# EAGLE design ashield (EAGLE 5.11)
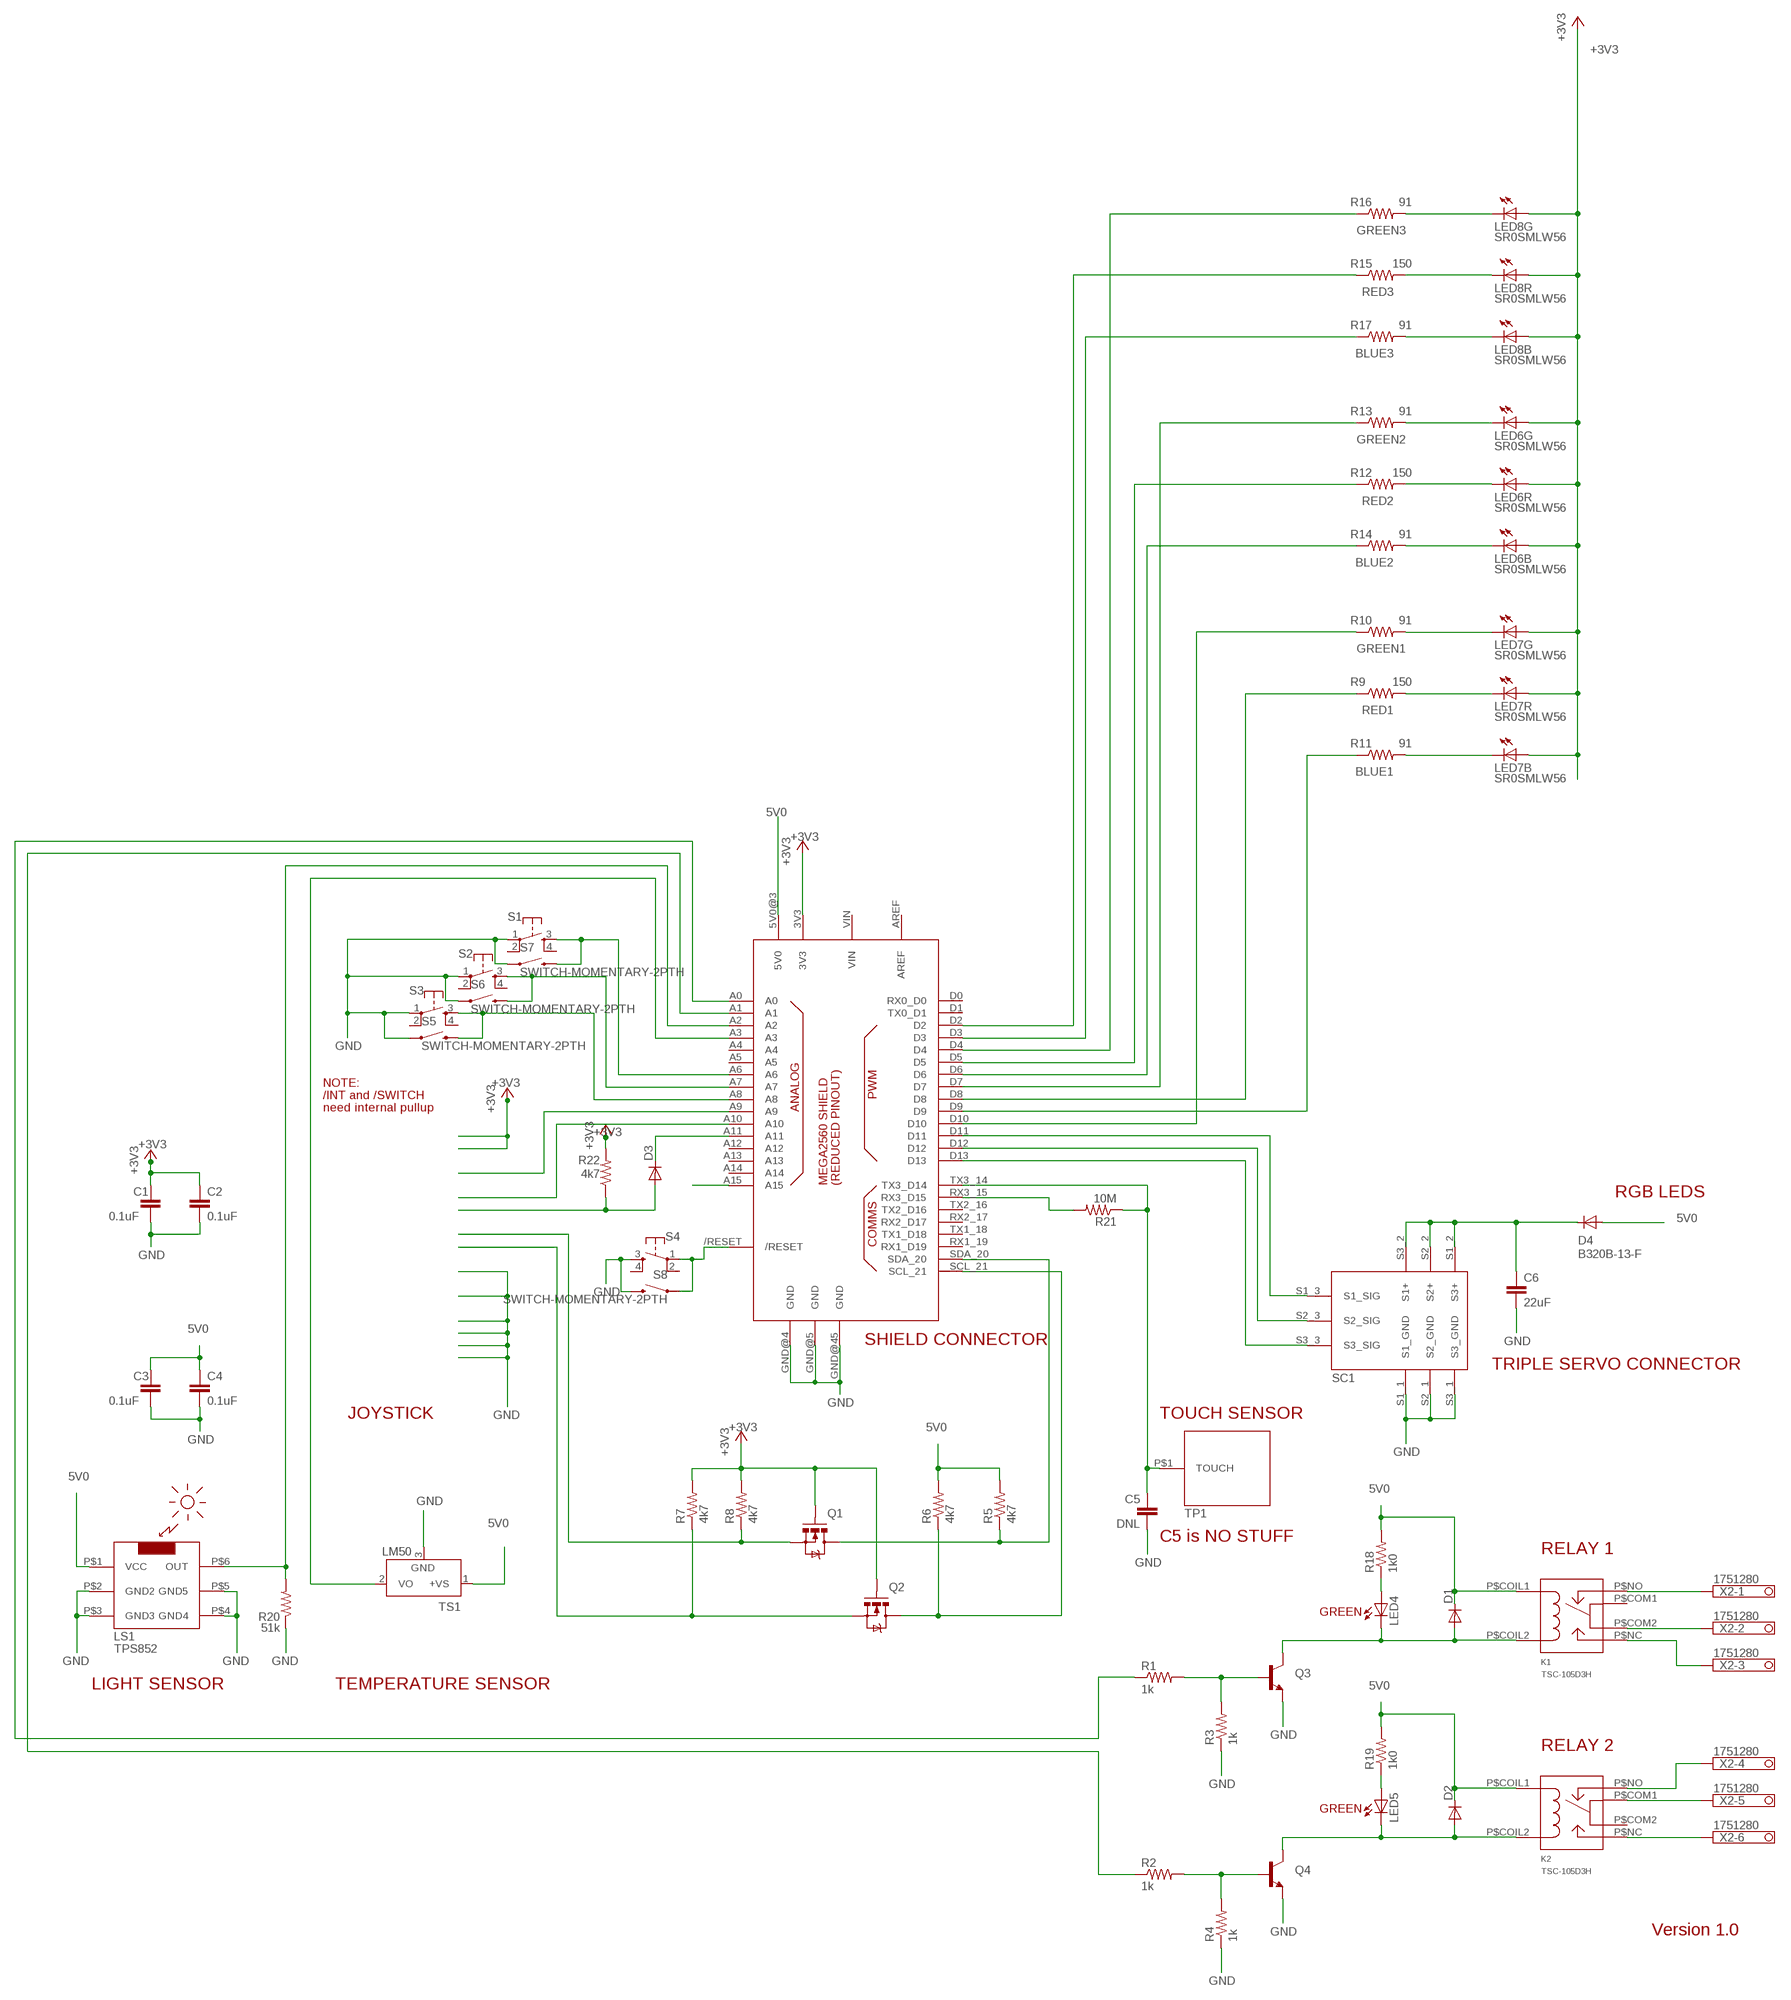
[diagram p0: schematic, sheet 1, part 1 of 2]
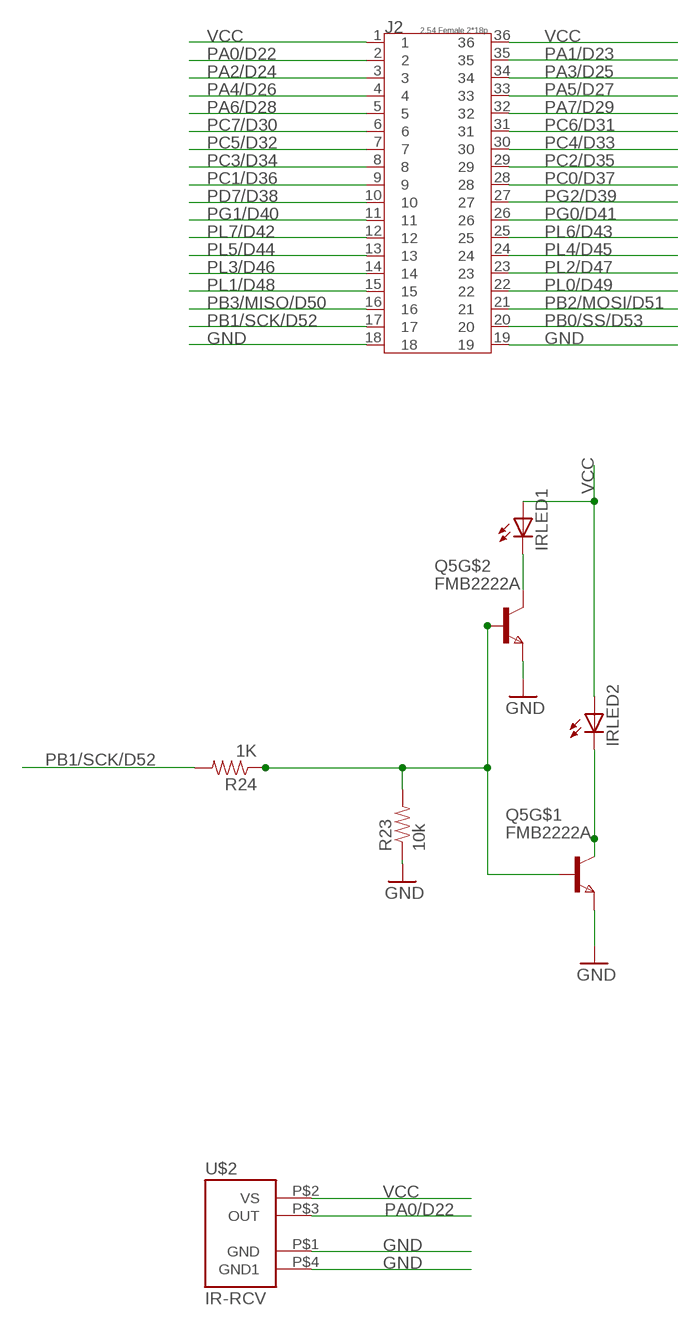
[diagram p1: schematic, sheet 1, part 2 of 2]

## Parts
BOARD1  MEGAARDUINO_REDUCED  [MEGA_ARDUINO_REDUCED]
C1  0.1uF  CAP0603-CAP  [0603-CAP]
C2  0.1uF  CAP0603-CAP  [0603-CAP]
C3  0.1uF  CAP0603-CAP  [0603-CAP]
C4  0.1uF  CAP0603-CAP  [0603-CAP]
C5  DNL  CAP0603-CAP  [0603-CAP]
C6  22uF  CAP1206  [1206]
D1  DIODESOD  [SOD-323]
D2  DIODESOD  [SOD-323]
D3  DIODESOD  [SOD-323]
D4  B320B-13-F  DIODESMA  [SMA-DIODE]
IRLED1  LED5MM  [LED5MM]
IRLED2  LED5MM  [LED5MM]
J2  2.54 Female 2*18p  HEADER-2X18P  [2.54-2X18P]
K1  TSC-105D3H  [TSC-105D3H]
K2  TSC-105D3H  [TSC-105D3H]
LED4  LEDCHIPLED_1206  [CHIPLED_1206]
LED5  LEDCHIPLED_1206  [CHIPLED_1206]
LED6  SR0SMLW56  LP2C63-ST-RGB-SR0SMLW56  [SMLW56]
LED7  SR0SMLW56  LP2C63-ST-RGB-SR0SMLW56  [SMLW56]
LED8  SR0SMLW56  LP2C63-ST-RGB-SR0SMLW56  [SMLW56]
LS1  TPS852  [TPS852]
Q1  MOSFET-NCHANNELSMD  [SOT23-3]
Q2  MOSFET-NCHANNELSMD  [SOT23-3]
Q3  TRANSISTOR_NPNSOT23-3  [SOT23-3]
Q4  TRANSISTOR_NPNSOT23-3  [SOT23-3]
Q5  FMB2222A  DUALNPN  [SSOT6]
R1  1k  RESISTOR0603-RES  [0603-RES]
R2  1k  RESISTOR0603-RES  [0603-RES]
R3  1k  RESISTOR0603-RES  [0603-RES]
R4  1k  RESISTOR0603-RES  [0603-RES]
R5  4k7  RESISTOR0603-RES  [0603-RES]
R6  4k7  RESISTOR0603-RES  [0603-RES]
R7  4k7  RESISTOR0603-RES  [0603-RES]
R8  4k7  RESISTOR0603-RES  [0603-RES]
R9  150  RESISTOR0603-RES  [0603-RES]
R10  91  RESISTOR0603-RES  [0603-RES]
R11  91  RESISTOR0603-RES  [0603-RES]
R12  150  RESISTOR0603-RES  [0603-RES]
R13  91  RESISTOR0603-RES  [0603-RES]
R14  91  RESISTOR0603-RES  [0603-RES]
R15  150  RESISTOR0603-RES  [0603-RES]
R16  91  RESISTOR0603-RES  [0603-RES]
R17  91  RESISTOR0603-RES  [0603-RES]
R18  1k0  RESISTOR0603-RES  [0603-RES]
R19  1k0  RESISTOR0603-RES  [0603-RES]
R20  51k  RESISTOR0603-RES  [0603-RES]
R21  10M  RESISTOR0603-RES  [0603-RES]
R22  4k7  RESISTOR0603-RES  [0603-RES]
R23  10k  RESISTOR0603-RES  [0603-RES]
R24  1K  RESISTOR0603-RES  [0603-RES]
S1  B3S-1000  [B3S-10XX]
S2  B3S-1000  [B3S-10XX]
S3  B3S-1000  [B3S-10XX]
S4  B3S-1000  [B3S-10XX]
S5  SWITCH-MOMENTARY-2PTH  [TACTILE-PTH]
S6  SWITCH-MOMENTARY-2PTH  [TACTILE-PTH]
S7  SWITCH-MOMENTARY-2PTH  [TACTILE-PTH]
S8  SWITCH-MOMENTARY-2PTH  [TACTILE-PTH]
SC1  3SERVOS  [3SERVOS]
TP1  ROBOT_TOUCHPADBARE  [ROBOT_50_TP_BARE]
TS1  LM50  [SOT23]
U$2  IR-RCV  [IR-RCV]
X2  1751280  [1751280]

## Nets
5V0: BOARD1.5V0@3(5V0) C3.1 C4.1 D1.1(C) D2.1(C) D4.A K1.P$COIL1(COIL1) K2.P$COIL1(COIL1) LS1.P$1(VCC) R5.2 R6.2 R18.2 R19.2 TS1.1(+VS)
+3V3: BOARD1.3V3 C1.1 C2.1 LED6.1(G:A) LED6.2(R:A) LED6.3(B:A) LED7.1(G:A) LED7.2(R:A) LED7.3(B:A) LED8.1(G:A) LED8.2(R:A) LED8.3(B:A) Q1.1(G) Q2.1(G) R7.2 R8.2 R22.2
/JOYINT: BOARD1.A10
/JOYSWITCH: BOARD1.A9
A15: BOARD1.A15
BLUE1: BOARD1.D9 R11.1
BLUE2: BOARD1.D6 R14.1
BLUE3: BOARD1.D3 R17.1
GND: BOARD1.GND@4(GND) BOARD1.GND@5(GND) BOARD1.GND@45(GND) C1.2 C2.2 C3.2 C4.2 C5.2 C6.2 J2.18 J2.19 LS1.P$2(GND2) LS1.P$3(GND3) LS1.P$4(GND4) LS1.P$5(GND5) Q3.2(E) Q4.2(E) Q5.2(E) Q5.5(E) R3.1 R4.1 R20.1 R23.1 S1.1(P) S2.1(P) S3.1(P) S4.3(S) S5.1 S6.1 S7.1 S8.3 SC1.S1_1(S1_GND) SC1.S2_1(S2_GND) SC1.S3_1(S3_GND) TS1.3(GND) U$2.P$1(GND) U$2.P$4(GND1)
GREEN1: BOARD1.D10 R10.1
GREEN2: BOARD1.D7 R13.1
GREEN3: BOARD1.D4 R16.1
K1_COM: K1.P$COM2(COM2) X2.2
K2_COM: K2.P$COM1(COM1) X2.5
LIGHT_VOLT: BOARD1.A2 LS1.P$6(OUT) R20.2
N$1: BOARD1./RESET S4.1(P) S8.1
N$2: LED8.6(G:C) R16.2
N$3: LED8.5(R:C) R15.2
N$4: LED8.4(B:C) R17.2
N$5: LED6.6(G:C) R13.2
N$6: LED6.5(R:C) R12.2
N$7: LED6.4(B:C) R14.2
N$8: LED7.6(G:C) R10.2
N$9: LED7.5(R:C) R9.2
N$10: LED7.4(B:C) R11.2
N$11: BOARD1.A6 S1.3(S) S7.3
N$12: BOARD1.A7 S2.3(S) S6.3
N$13: BOARD1.A8 S3.3(S) S5.3
N$14: BOARD1.RX3_15(RX3_D15) R21.2
N$15: D1.2(A) K1.P$COIL2(COIL2) LED4.C Q3.3(C)
N$16: D2.2(A) K2.P$COIL2(COIL2) LED5.C Q4.3(C)
N$17: BOARD1.TX3_14(TX3_D14) C5.1 R21.1 TP1.P$1(TOUCH)
N$18: C6.1 D4.C SC1.S1_2(S3+) SC1.S2_2(S2+) SC1.S3_2(S1+)
N$19: D3.2(A) R22.1
N$20: BOARD1.A11 D3.1(C)
N$21: K1.P$NO(NO) X2.1
N$22: K1.P$NC(NC) X2.3
N$23: K2.P$NC(NC) X2.6
N$24: K2.P$NO(NO) X2.4
N$25: Q3.1(B) R1.2 R3.2
N$26: Q4.1(B) R2.2 R4.2
N$27: Q5.1(B) Q5.3(B) R23.2 R24.1
N$29: LED4.A R18.1
N$30: LED5.A R19.1
N$31: IRLED1.K(C) Q5.4(C)
N$32: IRLED2.K(C) Q5.6(C)
PA0/D22: J2.2 U$2.P$3(OUT)
PA1/D23: J2.35
PA2/D24: J2.3
PA3/D25: J2.34
PA4/D26: J2.4
PA5/D27: J2.33
PA6/D28: J2.5
PA7/D29: J2.32
PB0/SS/D53: J2.20
PB1/SCK/D52: J2.17 R24.2
PB2/MOSI/D51: J2.21
PB3/MISO/D50: J2.16
PC0/D37: J2.28
PC1/D36: J2.9
PC2/D35: J2.29
PC3/D34: J2.8
PC4/D33: J2.30
PC5/D32: J2.7
PC6/D31: J2.31
PC7/D30: J2.6
PD7/D38: J2.10
PG0/D41: J2.26
PG1/D40: J2.11
PG2/D39: J2.27
PL0/D49: J2.22
PL1/D48: J2.15
PL2/D47: J2.23
PL3/D46: J2.14
PL4/D45: J2.24
PL5/D44: J2.13
PL6/D43: J2.25
PL7/D42: J2.12
RED1: BOARD1.D8 R9.1
RED2: BOARD1.D5 R12.1
RED3: BOARD1.D2 R15.1
RELAY1: BOARD1.A0 R1.1
RELAY2: BOARD1.A1 R2.1
SCL_3V3: Q2.2(S) R7.1
SCL_5V: BOARD1.SCL_21 Q2.3(D) R6.1
SDA_3V3: Q1.2(S) R8.1
SDA_5V: BOARD1.SDA_20 Q1.3(D) R5.1
SERVO1: BOARD1.D11 SC1.S1_3(S1_SIG)
SERVO2: BOARD1.D12 SC1.S2_3(S2_SIG)
SERVO3: BOARD1.D13 SC1.S3_3(S3_SIG)
TEMP_1WIRE: BOARD1.A3 TS1.2(VO)
VCC: IRLED1.A IRLED2.A J2.1 J2.36 U$2.P$2(VS)
Unconnected: BOARD1.A4 BOARD1.A5 BOARD1.A12 BOARD1.A13 BOARD1.A14 BOARD1.D0(RX0_D0) BOARD1.D1(TX0_D1) BOARD1.RX1_19(RX1_D19) BOARD1.RX2_17(RX2_D17) BOARD1.TX1_18(TX1_D18) BOARD1.TX2_16(TX2_D16) K1.P$COM1(COM1) K2.P$COM2(COM2) S1.2(P1) S1.4(S1) S2.2(P1) S2.4(S1) S3.2(P1) S3.4(S1) S4.2(P1) S4.4(S1)

## Notes on the sheet
- NOTE:
- /INT and /SWITCH
- need internal pullup
- RGB LEDS
- SHIELD CONNECTOR
- TRIPLE SERVO CONNECTOR
- JOYSTICK | TOUCH SENSOR
- C5 is NO STUFF
- RELAY 1
- GREEN
- LIGHT SENSOR | TEMPERATURE SENSOR
- RELAY 2
- GREEN
- Version 1.0

## Power pins joined to a net without a drawn wire
AREF: BOARD1.AREF
VIN: BOARD1.VIN

## Library data of the parts
BOARD1 = ashield:MEGAARDUINO_REDUCED
C1-C6 = SparkFun:CAP: Capacitor Standard 0603 ceramic capacitor, and 0.1" leaded capacitor.
D1-D4 = SparkFun:DIODE: Diode These are standard reverse protection diodes and small signal diodes. SMA package can handle up to about 1A. SOD-323 can handle about 200mA. What the SOD-323 package when ordering, there are some mfgs out there that are 5-pin packages.
IRLED1 IRLED2 LED4 LED5 = led:LED: LED OSRAM: - CHIPLED LG R971, LG N971, LY N971, LG Q971, LY Q971, LO R971, LY R971 LH N974, LH R974 LS Q976, LO Q976, LY Q976 LO Q996 - Hyper CHIPLED LW Q18S LB Q993, LB Q99A, LB R99A - SideLED LS A670, LO A670, LY A670, LG A670, LP A670 LB A673, LV A673, LT A673, LW A673 LH A674 LY A675 LS A676, LA A676, LO A676, LY A676, LW A676 LS A679, LY A679, LG A679 - Hyper Micro SIDELED® LS Y876, LA Y876, LO Y876, LY Y876 LT Y87S - SmartLED LW L88C, LW L88S LB L89C, LB L89S, LG L890 LS L89K, LO L89K, LY L89K LS L896, LA L896, LO L896, LY L896 - TOPLED LS T670, LO T670, LY T670, LG T670, LP T670 LSG T670, LSP T670, LSY T670, LOP T670, LYG T670 LG T671, LOG T671, LSG T671 LB T673, LV T673, LT T673, LW T673 LH T674 LS T676, LA T676, LO T676, LY T676, LB T676, LH T676, LSB T676, LW T676 LB T67C, LV T67C, LT T67C, LS T67K, LO T67K, LY T67K, LW E67C LS E67B, LA E67B, LO E67B, LY E67B, LB E67C, LV E67C, LT E67C LW T67C LS T679, LY T679, LG T679 LS T770, LO T770, LY T770, LG T770, LP T770 LB T773, LV T773, LT T773, LW T773 LH T774 LS E675, LA E675, LY E675, LS T675 LS T776, LA T776, LO T776, LY T776, LB T776 LHGB T686 LT T68C, LB T68C - Hyper Mini TOPLED® LB M676 - Mini TOPLED Santana® LG M470 LS M47K, LO M47K, LY M47K Source: http://www.osram.convergy.de LUXEON: - LUMILED® LXK2-PW12-R00, LXK2-PW12-S00, LXK2-PW14-U00, LXK2-PW14-V00 LXK2-PM12-R00, LXK2-PM12-S00, LXK2-PM14-U00 LXK2-PE12-Q00, LXK2-PE12-R00, LXK2-PE12-S00, LXK2-PE14-T00, LXK2-PE14-U00 LXK2-PB12-K00, LXK2-PB12-L00, LXK2-PB12-M00, LXK2-PB14-N00, LXK2-PB14-P00, LXK2-PB14-Q00 LXK2-PR12-L00, LXK2-PR12-M00, LXK2-PR14-Q00, LXK2-PR14-R00 LXK2-PD12-Q00, LXK2-PD12-R00, LXK2-PD12-S00 LXK2-PH12-R00, LXK2-PH12-S00 LXK2-PL12-P00, LXK2-PL12-Q00, LXK2-PL12-R00 Source: www.luxeon.com KINGBRIGHT: KA-3528ASYC Source: www.kingbright.com
J2 = Connector:HEADER-2X18P
K1 K2 = Relay_Type:TSC-105D3H
LED6-LED8 = led:LP2C63-ST-RGB-SR0: 1.5W RGB HIGH POWER LED Source: http://www.ledtech.com.tw .. LP2C63-ST-RGB-SR0.SPEC.pdf
LS1 = toshiba_light_sensor:TPS852
Q1 Q2 = SparkFun:MOSFET-NCHANNEL
Q3 Q4 = SparkFun:TRANSISTOR_NPN: Transistor NPN BJT configuration in SOT23 package. MMBT2222 is the common NPN we use. Double check BCE configuration again layout.
Q5 = fairchild-semic:DUALNPN
R1-R24 = SparkFun:RESISTOR: Resistor Basic schematic elements and footprints for 0603, 1206, and PTH 1/10th watt (small) resistors.
S1-S4 = switch-omron:B3S-1000: Omron Surface Mount Switch, 160g operating force, 4.3mm actuator height, sealed for immersion cleaning
S5-S8 = SparkFun:SWITCH-MOMENTARY-2
SC1 = servocon:3SERVOS
TP1 = logos:ROBOT_TOUCHPAD
TS1 = linear:LM50: SOT-23 Single-Supply Centigrade Temperature Sensor Vout = (10mV/°C x Temp °C) +5mmmV Source: http://cache.national.com/ds/LM/LM50.pdf
U$2 = IR-rcv:IR-RCV
X2 = con-phoenix-350:1751280: MKDS 1/ 6-3,5 Printklemme Nennstrom: 10 A Bemessungsspannung: 160 V Raster: 3,5 mm Polzahl: 6 Montageart: Löten Anschlussart: Schraubanschluss Anschlussrichtung vom Leiter zur Platine: 0° Source: http://eshop.phoenixcontact.com .. 1751280.pdf; MPN: 1751280; OC_FARNELL: unknown; OC_NEWARK: 27R1765

## Board
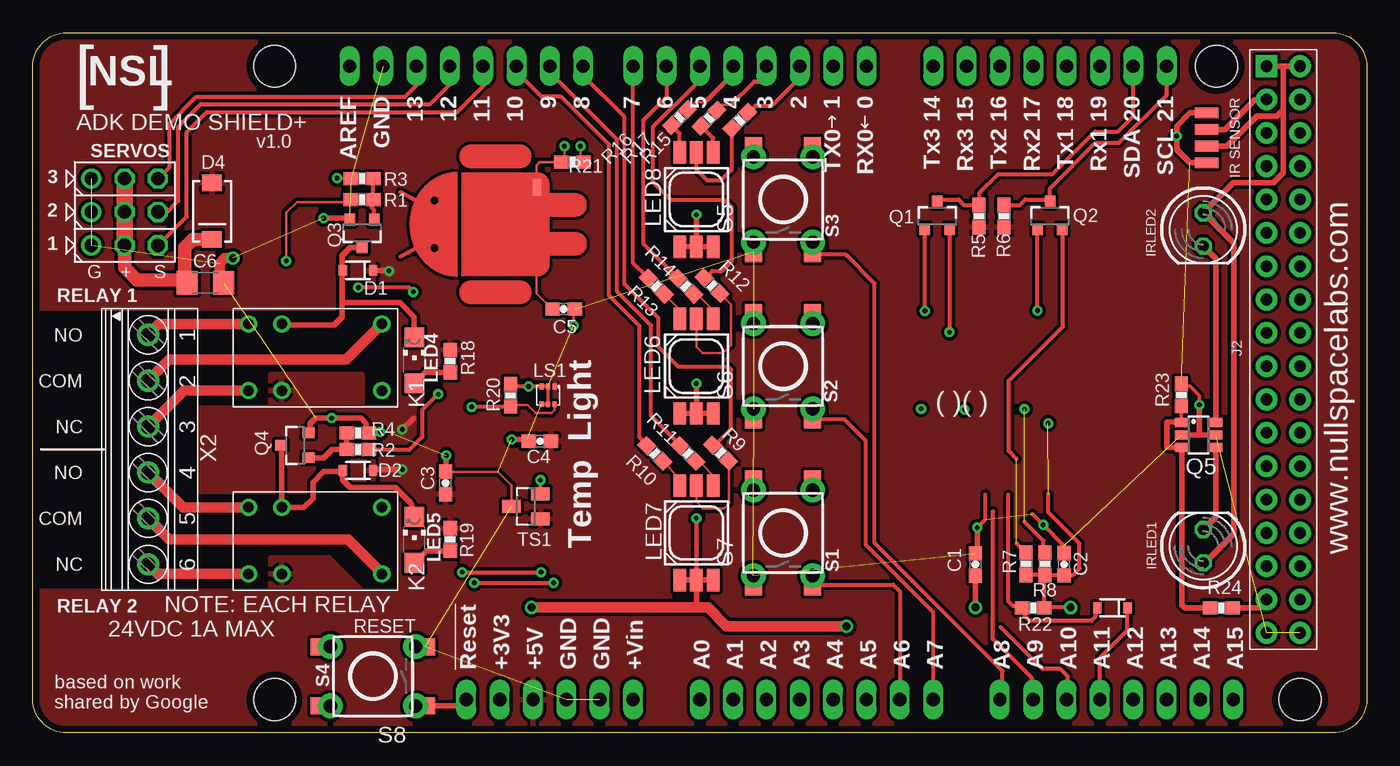
[diagram p2: board, top side]
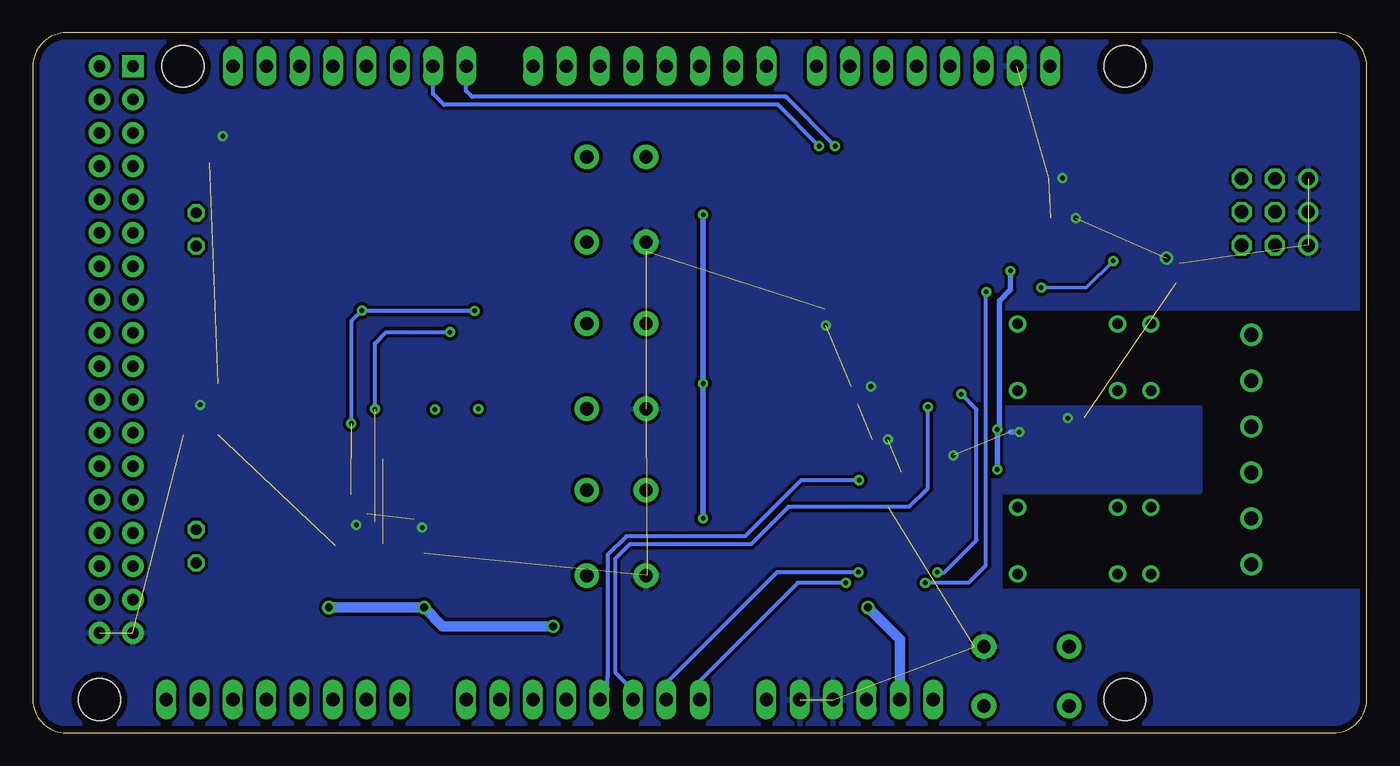
[diagram p3: board, bottom side, seen from below]

Size 101.6 x 53.34 mm. Coordinates in mm from the lower left corner, seen from the top.
Copper layers (1*16): Top 0.0356mm / dielectric 1.5011mm / Bottom 0.0356mm
Design rules "SilverCircuits *": minimum track width 7mil, minimum drill 14mil, track to track 7mil, track to pad 7mil, pad to pad 7mil, via to via 7mil, smd to smd 0mil, copper to edge 20mil, drill to drill 8mil, minimum pad ring 10mil, minimum via ring 8mil, stop-mask expansion 4mil, vias tented up to drill 0mil, thermal gap 10mil

### Footprints (pad centres in the part's own frame; a part is rotated, then mirrored left to right if it is on the bottom)
MEGA_ARDUINO_REDUCED = drill 1.016 long: 3V3 35.56,2.54; 5V0@3 38.1,2.54; /RESET 33.02,2.54; A0 50.8,2.54; A1 53.34,2.54; A2 55.88,2.54; A3 58.42,2.54; A4 60.96,2.54; A5 63.5,2.54; A6 66.04,2.54; A7 68.58,2.54; A8 73.66,2.54; A9 76.2,2.54; A10 78.74,2.54; A11 81.28,2.54; A12 83.82,2.54; A13 86.36,2.54; A14 88.9,2.54; A15 91.44,2.54; AREF 24.13,50.8; D0 63.5,50.8; D1 60.96,50.8; D2 58.42,50.8; D3 55.88,50.8; D4 53.34,50.8; D5 50.8,50.8; D6 48.26,50.8; D7 45.72,50.8; D8 41.91,50.8; D9 39.37,50.8; D10 36.83,50.8; D11 34.29,50.8; D12 31.75,50.8; D13 29.21,50.8; GND@4 40.64,2.54; GND@5 43.18,2.54; GND@45 26.67,50.8; RX1_19 81.28,50.8; RX2_17 76.2,50.8; RX3_15 71.12,50.8; SCL_21 86.36,50.8; SDA_20 83.82,50.8; TX1_18 78.74,50.8; TX2_16 73.66,50.8; TX3_14 68.58,50.8; VIN 45.72,2.54 | hole 3.2: 18.415,50.8; 18.415,2.54; 90.17,50.8; 96.52,2.54
0603-CAP = smd 1.1 x 1: 1 -0.85,0; 2 0.85,0
1206 = smd 1.6 x 1.8: 1 -1.4,0; 2 1.4,0
SOD-323 = smd 0.63 x 0.83: 1 -1.15,0; 2 1.15,0
SMA-DIODE = smd 1.27 x 1.47: A -2.15,0; C 2.15,0
LED5MM = drill 0.813 octagon: A -1.27,0; K 1.27,0
2.54-2X18P = drill 0.889 pad 1.651 square: 1 -1.27,21.59 | drill 0.889 pad 1.651 round: 2 -1.27,19.05; 3 -1.27,16.51; 4 -1.27,13.97; 5 -1.27,11.43; 6 -1.27,8.89; 7 -1.27,6.35; 8 -1.27,3.81; 9 -1.27,1.27; 10 -1.27,-1.27; 11 -1.27,-3.81; 12 -1.27,-6.35; 13 -1.27,-8.89; 14 -1.27,-11.43; 15 -1.27,-13.97; 16 -1.27,-16.51; 17 -1.27,-19.05; 18 -1.27,-21.59; 19 1.27,-21.59; 20 1.27,-19.05; 21 1.27,-16.51; 22 1.27,-13.97; 23 1.27,-11.43; 24 1.27,-8.89; 25 1.27,-6.35; 26 1.27,-3.81; 27 1.27,-1.27; 28 1.27,1.27; 29 1.27,3.81; 30 1.27,6.35; 31 1.27,8.89; 32 1.27,11.43; 33 1.27,13.97; 34 1.27,16.51; 35 1.27,19.05; 36 1.27,21.59
TSC-105D3H = drill 0.8 round: P$COIL1 -2.5,2.62; P$COIL2 2.58,2.62; P$COM1 -2.5,-5; P$COM2 2.58,-5; P$NC -2.5,5.16; P$NO 2.58,5.16
CHIPLED_1206 = smd 1.5 x 1.5: A 0,-1.75; C 0,1.75
SMLW56 = smd 1.7 x 0.96: 1 -3.6,1.27; 2 -3.6,0; 3 -3.6,-1.27; 4 3.6,-1.27; 5 3.6,0; 6 3.6,1.27
TPS852 = smd 0.3 x 0.45: P$1 -0.5,-0.675; P$2 0,-0.675; P$3 0.5,-0.675; P$4 0.5,0.675; P$5 0,0.675; P$6 -0.5,0.675
SOT23-3 = smd 0.8 x 0.9: 1 -0.95,-1; 2 0.95,-1; 3 0,1.1
SSOT6 = smd 0.69 x 0.99: 1 -0.95,-1.3; 2 0,-1.3; 3 0.95,-1.3; 4 0.95,1.3; 5 0,1.3; 6 -0.95,1.3
0603-RES = smd 1.1 x 1: 1 -0.85,0; 2 0.85,0
B3S-10XX = smd 1.55 x 1.3: 1 3.975,-2.25; 2 -3.975,-2.25; 3 3.975,2.25; 4 -3.975,2.25
TACTILE-PTH = drill 1.016 pad 1.88 round: 1 -3.251,2.261; 2 3.251,2.261; 3 -3.251,-2.261; 4 3.251,-2.261
3SERVOS = drill 1.016 round: S1_1 -2.54,-2.54; S2_1 -2.54,0; S3_1 -2.54,2.54 | drill 1.016 octagon: S1_2 0,-2.54; S1_3 2.54,-2.54; S2_2 0,0; S2_3 2.54,0; S3_2 0,2.54; S3_3 2.54,2.54
ROBOT_50_TP_BARE = smd 1.27 x 0.635: P$1 8.89,3.81
SOT23 = smd 1 x 1.4: 1 -0.95,-1.1; 2 0.95,-1.1; 3 0,1.1
IR-RCV = smd 0.8 x 1.8: P$1 -1.27,0; P$2 0,0; P$3 1.27,0; P$4 2.54,0
1751280 = drill 1.1 pad 1.7 round: 1 -8.75,-0.1; 2 -5.25,-0.1; 3 -1.75,-0.1; 4 1.75,-0.1; 5 5.25,-0.1; 6 8.75,-0.1

### Placement (x,y rotation side)
BOARD1  0,0 0 top
C1  71.81,12.83 90 top
C2  78.55,12.85 90 top
C3  31.43,19.05 90 top
C4  38.62,22.23 180 top
C5  40.44,32.28 0 top
C6  13.14,34.29 0 top
D1  24.77,35.24 180 top
D2  24.77,20 180 top
D3  82.23,9.53 180 top
D4  13.65,39.75 270 top
IRLED1  89.15,14.22 90 top
IRLED2  89.15,38.35 270 top
J2  95.25,29.21 0 top
K1  21.59,28.57 90 top
K2  21.59,14.61 90 top
LED4  29.06,28.4 0 top
LED5  29.06,14.71 0 top
LED6  50.55,27.94 90 top
LED7  50.55,15.24 90 top
LED8  50.55,40.64 90 top
LS1  39.26,25.72 180 top
Q1  68.9,39.37 0 top
Q2  77.47,39.37 0 top
Q3  25.08,38.1 180 top
Q4  20,21.91 90 top
Q5  88.8,22.71 270 top
R1  25.08,40.64 0 top
R2  24.77,21.59 180 top
R3  25.08,42.23 0 top
R4  24.77,22.86 180 top
R5  72.07,39.37 270 top
R6  73.98,39.37 270 top
R7  75.65,12.88 270 top
R8  77.09,12.88 270 top
R9  52.39,21.34 315 top
R10  47.38,21.29 315 top
R11  49.89,21.29 315 top
R12  51.73,34.09 315 top
R13  47.49,34.04 315 top
R14  49.73,34.04 315 top
R15  53.85,46.67 225 top
R16  49.26,46.89 225 top
R17  51.51,46.84 225 top
R18  31.8,28.32 90 top
R19  31.8,14.73 90 top
R20  36.4,25.72 270 top
R21  41.1,43.48 0 top
R22  76.2,9.53 0 top
R23  87.48,25.76 270 top
R24  90.53,9.53 0 top
S1  57.15,15.24 270 top
S2  57.15,27.94 270 top
S3  57.15,40.64 270 top
S4  25.91,4.32 0 top
S5  57.15,40.64 90 top
S6  57.15,27.94 90 top
S7  57.15,15.24 90 top
S8  25.91,4.32 180 top
SC1  6.99,39.69 0 top
TP1  42.19,32.69 90 top
TS1  37.56,17.25 90 top
U$2  89.41,44.7 90 top
X2  8.89,21.59 270 top

### Tracks (layer width: path | path; a pad name or v marks a point on that pad's centre or on a via)
5V0  (via drill 0.36)
  Top 0.406: v28.14,23.11 29,23.97 | v28.14,20.07 25.98,20.07 D2.1 | D1.1 27.09,35.24 v27.13,35.2
  Bottom 0.406: v28.14,20.07 v28.14,23.11 27.99,23.27 27.99,32.92 27.13,33.78 v27.13,35.2
  pour Top (isolate 0.254): 0,10.79 18.1,10.79 18.1,13.34 22.54,13.34 25.08,10.79 27.94,10.79 27.94,18.41 12.7,18.41 12.7,24.77 18.1,24.77 18.1,27.3 25.08,27.3 25.08,24.77 27.94,24.77 27.94,32.38 0,32.38 0,53.34 101.6,53.34 101.6,0 0,0
+3V3  (via drill 0.36, 0.6)  (1 unrouted)
  Top 0.203: 76.88,9.55 76.93,9.5
  Top 0.254: Q2.1 76.73,38.16
  Top 0.305: v79.05,9.55 76.88,9.55 R22.2 77.05,11.99 R8.2 | 77.33,18.17 77.34,18.19 77.34,16.82 79.73,14.43 79.73,12.52 79.25,12.04 78.59,12.04 C2.1 78.52,12.03 R8.2 | R8.2 R7.2 | Q1.1 v67.95,32.16 v67.94,32.16 | v76.53,32.18 Q2.1 | v77.34,23.57 77.33,23.56
  Top 0.356: LED7.2 v50.55,16.36
  Top 0.406: v71.81,9.55 71.81,12.12 | LED8.2 LED8.1 | LED8.2 LED8.3 | v50.55,39.47 LED8.2 | v50.55,26.62 LED6.2 | LED6.2 LED6.1 | LED6.2 LED6.3 | 50.55,9.55 LED7.2 | LED7.2 LED7.1 | LED7.2 LED7.3
  Top 0.61: v79.05,9.55 79.06,9.56
  Top 0.813: v38,9.55 50.55,9.55 51.41,9.55 52.83,8.13 v61.98,8.13 | 71.81,12.12 C1.1
  Bottom 0.305: v67.94,32.16 76.5,32.16 v76.53,32.18 77.34,31.37 v77.34,23.57
  Bottom 0.406: v50.55,39.47 v50.55,26.62 v50.55,16.36
  Bottom 0.813: v38,9.55 35.56,7.11 BOARD1.3V3 | v61.98,8.13 70.38,8.13 v71.81,9.55 v79.05,9.55
/JOYINT
  Top 0.305: 73.73,8.06 76.91,4.88 78.26,4.88 78.79,4.34 78.79,2.59 BOARD1.A10
/JOYSWITCH
  Top 0.305: 73.13,16.87 73.13,7.16 76.1,4.19 76.1,2.64 BOARD1.A9
BLUE1
  Top 0.305: BOARD1.D9 39.93,50.24 39.93,49.78 44.5,45.21 44.5,33.63 47.09,31.04 47.09,24.13 49.28,21.94 R11.1
BLUE2
  Top 0.305: BOARD1.D6 48.26,49.43 48.31,49.38 48.31,48.46 46.53,46.69 46.53,37.24 R14.1
BLUE3
  Top 0.203: 53.19,47.85 52.53,47.85 R17.1
  Top 0.305: BOARD1.D3 55.58,50.49 55.58,49.63 | 53.19,47.85 54.97,49.63
  Top 0.356: 54.97,49.63 55.58,49.63
GND  (via drill 0.36, 0.6)  (23 unrouted)
  Top 0.203: R3.1 24.25,42.27 v23.16,42.27 | S3.1 54.96,36.73 | S5.1 54.91,37.39 | S6.1 | S7.1 54.81,11.99 | TS1.3 36.46,18.86 35.42,19.9 C3.2 31.45,19.91 | C5.2 41.2,32.2 v41.2,31.04
  Top 0.254: LS1.P$5 LS1.P$2 | v88.85,24.99 88.85,25.7 88.14,26.42 87.49,26.42 R23.1
  Top 0.305: LS1.P$2 LS1.P$3 v37.76,26.39 36.42,26.39 R20.1 | LS1.P$4 LS1.P$5 | 72.54,18.16 72.54,16.26 v71.93,15.65 | 76.13,16.68 v76.96,15.85 78.55,14.26 C2.2
  Top 0.406: Q4.2 21.13,22.99 21.13,23.57 21.54,23.98 v22.76,23.98 24.99,23.98 25.4,23.57 25.4,22.88 R4.1 25.47,22.91 v26.47,22.91 | C1.2 71.93,14.04 v71.93,15.65 | C3.2 31.5,19.9 v31.5,21.13 | C4.2 37.64,22.35 v36.47,22.35 | Q3.2 24.08,39.22 v22.15,39.22 | U$2.P$4 88.14,47.24 87.12,46.23 v87.12,45.47 87.12,44.45 88.14,43.43 U$2.P$1 | Q5.2 88.75,22.71 | 88.75,22.71 Q5.5 | v88.85,24.99 88.85,22.81 88.75,22.71 | S3.1 54.91,36.66 54.91,37.39 | S6.1 S2.1 | S1.1 54.81,11.27 54.81,11.99 | S8.3 29.17,6.57 S4.3
  Top 0.61: C6.2 14.22,34.29
  Top 0.813: v15.24,36.17 14.63,36.17 14.22,35.76 14.22,34.29
  Bottom 0.305: v76.96,15.85 76.96,15.8 77.04,15.72
  Bottom 0.406: v26.47,22.91 27.13,22.91
  pour Bottom (isolate 0.254): 0,0 0,10.79 27.94,10.79 27.94,18.41 12.7,18.41 12.7,24.77 27.94,24.77 27.94,32.38 0,32.38 0,53.34 101.6,53.34 101.6,0
GREEN1
  Top 0.305: BOARD1.D10 37.39,50.24 37.39,49.84 38.76,48.46 40.23,48.46 43.89,44.81 43.89,33.33 46.23,30.99 46.23,22.5 46.78,21.95 R10.1
GREEN2
  Top 0.203: R13.1 46.8,34.38 | R13.1 46.59,34.59 | R13.1 46.54,34.64 | 45.77,50.75 BOARD1.D7
  Top 0.305: 45.77,50.75 45.77,49.48 45.72,49.43 45.72,35.8 R13.1
GREEN3
  Top 0.203: 51.21,48.06 50.49,48.06 49.93,47.49 R16.1
  Top 0.305: BOARD1.D4 52.88,50.34 52.88,49.73
  Top 0.356: 51.21,48.06 52.88,49.73
K1_COM
  Top 0.813: X2.2 10.4,28.45 23.88,28.45 K1.P$COM2
K2_COM
  Top 0.813: X2.5 10.4,14.73 24,14.73 26.59,12.14 K2.P$COM1
LIGHT_VOLT  (via drill 0.36)
  Top 0.203: 39.78,24.95 LS1.P$6 39.73,25.01 39.73,24.59 39.52,24.38 38.3,24.38 37.69,24.99 36.47,24.99 R20.2
  Top 0.305: v33.43,24.84 33.45,24.87 R20.2
  Bottom 0.305: BOARD1.A2 55.88,3.66 56.29,3.66 57.25,4.62 57.25,13.26 56.13,14.38 46.89,14.38 44.04,17.22 34.85,17.22 33.43,18.64 v33.43,24.84
N$1
  Top 0.406: BOARD1./RESET 32.54,2.06 S8.1 S4.1
N$2
  Top 0.305: LED8.6 49.28,45.67 R16.2
N$3
  Top 0.305: R15.2 53.25,42.93 52.43,42.11 51.36,42.11 50.55,42.93 LED8.5
N$4
  Top 0.305: LED8.4 51.82,45.33 R17.2
N$5
  Top 0.203: R13.2 49.28,32.24 LED6.6
N$6
  Top 0.203: LED6.5 50.55,29.41 51,28.96 52.58,28.96 53.19,29.57 53.19,32.63 R12.2
N$7
  Top 0.203: LED6.4 51.77,31.59 51.77,32.26 50.59,33.44 R14.2
N$8
  Top 0.203: R10.2 49.28,19.39 LED7.6
N$9
  Top 0.203: LED7.5 50.55,17.63 51.05,17.12 52.63,17.12 53.03,17.53 53.03,20.69 R9.2
N$10
  Top 0.203: R11.2 50.7,20.47 50.95,20.47 51.82,19.61 LED7.4
N$11
  Top 0.203: S7.3 59.3,11.99
  Top 0.305: S1.3 59.41,11.28 65.53,11.28 66.04,10.77 BOARD1.A6
  Top 0.406: 59.3,11.99 S1.3
N$12
  Top 0.203: S6.3
  Top 0.305: S2.3 59.49,23.88 61.82,23.88 63.45,22.25 63.45,14.33 68.58,9.2 BOARD1.A7
  Top 0.406: S2.3 S6.3
N$13
  Top 0.203: S5.3
  Top 0.305: S3.3 59.64,36.42 61.92,36.42 64.11,34.24 64.11,14.48 73.86,4.72 73.86,3.35 73.66,3.15 BOARD1.A8
  Top 0.406: S3.3 S5.3
N$14  (via drill 0.36)
  Top 0.203: v41.71,44.7 41.71,43.73 R21.2
  Bottom 0.305: BOARD1.RX3_15 71.12,48.69 70.28,47.85 44.86,47.85 v41.71,44.7
N$15
  Top 0.406: K1.P$COIL2 19.04,31.09 22.96,31.09 23.57,31.7 23.57,32.69 | Q3.3 24.93,36.98 24.18,36.98 23.57,36.37 23.57,35.34 D1.2 23.57,35.15 23.57,32.69 | LED4.C 29.06,31.7 27.96,32.79 23.67,32.79 23.57,32.69
N$16
  Top 0.406: Q4.3 18.97,21.84 K2.P$COIL2 20.64,17.18 21.34,17.88 21.34,19.1 22.15,19.91 23.53,19.91 D2.2 23.61,19.26 24.18,18.69 27.58,18.69 28.81,17.47 LED5.C
N$17  (via drill 0.36)
  Top 0.203: v40.49,44.7 40.49,43.73 R21.1 38.61,43.48 38.35,43.23 38.35,42.72 38.38,42.7 TP1.P$1 38.38,33.49 C5.1
  Bottom 0.305: BOARD1.TX3_14 68.58,49.4 68.61,49.38 68.61,48.92 68.15,48.46 44.25,48.46 v40.49,44.7
N$18
  Top 1.016: SC1.S2_2 6.99,35.47 7.94,34.52 11.2,34.52 | 11.2,34.52 C6.1 | 11.2,34.52 11.56,34.52 11.58,34.54 11.58,36.98 12.19,37.59 13.33,37.59 D4.C
  Top 1.27: SC1.S3_2 SC1.S2_2 SC1.S1_2
N$19
  Top 0.203: 80.96,9.4 D3.2 | 75.56,9.54 R22.1 75.22,9.65
  Top 0.305: 80.96,9.4 80.96,8.89 80.64,8.57 75.88,8.57 75.55,8.9 R22.1 | 74.3,18.14 74.3,10.03 74.68,9.65 75.22,9.65
N$20
  Top 0.305: BOARD1.A11 81.28,5.71 83.38,7.82 D3.1
N$21
  Top 0.813: K1.P$NO 9.61,31.16 X2.1
N$22
  Top 0.813: K1.P$NC 11.53,26.07 X2.3
N$23
  Top 0.813: K2.P$NC 9.53,12.11 X2.6
N$24
  Top 0.813: K2.P$NO 11.45,17.18 X2.4
N$25
  Top 0.305: Q3.1 26.01,39.19 26.01,39.83 25.8,40.04 25.8,40.43 R1.2 R3.2
N$26
  Top 0.406: R4.2 R2.2 22.81,21.59 22.15,20.93 21.03,20.93 Q4.1
N$27
  Top 0.254: 87.63,23.79 87.48,23.94 R23.2
  Top 0.406: 87.63,23.79 Q5.1 87.48,23.67 86.41,23.67 86.36,23.62 86.36,21.79 86.4,21.76 Q5.3 87.53,21.76 87.53,9.75 87.76,9.53 R24.1
N$29
  Top 0.406: R18.1 29.88,27.47 LED4.A
N$30
  Top 0.406: R19.1 29.98,13.88 LED5.A
N$31
  Top 0.406: Q5.4 90.1,16.44 IRLED1.K
N$32
  Top 0.406: IRLED2.K 90.1,36.14 Q5.6
N$33  (via drill 0.36)
  other vias: 67.67,24.69
N$34  (via drill 0.36)
  other vias: 70.97,24.64
PA0/D22
  Top 0.406: J2.2 93.07,48.26 90.78,45.97 U$2.P$3
PB1/SCK/D52
  Top 0.406: J2.17 93.34,9.53 R24.2
RED1
  Top 0.305: BOARD1.D8 41.91,50.09 45.06,46.94 45.06,34.19 47.65,31.6 47.65,29.41 49.17,27.89 52.98,27.89 53.19,27.69 53.19,23.16 51.96,21.94 R9.1
RED2
  Top 0.203: R12.1 51.25,34.69
  Top 0.305: 51.25,34.69 51.77,35.2 52.48,35.2 53.24,35.97 53.24,40.03 52.68,40.59 48.62,40.59 47.24,41.96 47.24,46.18 50.55,49.48 50.55,50.55 BOARD1.D5
RED3
  Top 0.203: R15.1 54.54,47.27
  Top 0.305: BOARD1.D2 58.42,49.94 56.29,47.8 55.07,47.8 54.54,47.27
RELAY1  (via drill 0.36)
  Top 0.203: R1.1 24.29,40.44 20.12,40.44 19.3,39.62 v19.3,35.97
  Top 0.305: v28.98,33.6 28.65,33.93 v24.79,33.93 | v33.63,11.43 v39.67,11.43
  Bottom 0.254: v24.79,33.93 21.34,33.93 v19.3,35.97
  Bottom 0.305: BOARD1.A0 50.8,3.96 43.33,11.43 v39.67,11.43 | v28.98,33.6 29.01,33.6 29.01,12.75 30.33,11.43 v33.63,11.43
RELAY2  (via drill 0.36)
  Top 0.203: 25.47,21.54 R2.1
  Top 0.305: v30.89,25.81 29.67,24.59 29.67,22.55 28.65,21.54 25.47,21.54 | v32.72,12.24 v38.71,12.24
  Bottom 0.203: v30.89,25.81 30.28,25.2 | BOARD1.A1 53.44,2.64
  Bottom 0.305: BOARD1.A1 53.29,2.59 53.29,3.86 44.91,12.24 v38.71,12.24 | v30.89,25.81 29.72,24.64 29.72,14.68 32.16,12.24 v32.72,12.24
SCL_3V3  (1 unrouted)
  Top 0.203: Q2.2 78.44,38.35
  Top 0.305: R7.1 74.93,14.45 | Q2.2 78.46,38.33 78.46,30.96 74.35,26.85 74.35,21.46 74.93,20.88
SCL_5V
  Top 0.203: R6.1 73.99,40.03 | 77.3,40.64 Q2.3
  Top 0.305: 77.3,40.64 75.59,40.64 75.17,40.22 R6.1 | BOARD1.SCL_21 86.36,48.59 82.73,44.96 80.95,44.96 77.47,41.48 Q2.3
SDA_3V3  (via drill 0.36)  (1 unrouted)
  Top 0.305: 75.53,16.09 76.99,14.63 76.99,13.83 R8.1 | Q1.2 69.85,30.55 v69.83,30.53 | v75.54,24.66 v75.53,24.65
  Bottom 0.305: v75.54,24.66 75.54,29.67 74.68,30.53 v69.83,30.53
SDA_5V
  Top 0.203: Q1.3 69.07,40.64
  Top 0.305: 69.07,40.64 70.51,40.64 70.93,40.22 R5.1 72.11,40.26 72.11,41.15 73.53,42.57 77.65,42.57 80.9,45.82 82.65,45.82 83.82,46.99 BOARD1.SDA_20
SERVO1
  Top 0.305: BOARD1.D11 34.29,49.38 34.34,49.33 32.31,47.3 13.26,47.3 11.73,45.77 11.73,39.32 9.56,37.15 SC1.S1_3
SERVO2
  Top 0.305: BOARD1.D12 31.8,50.75 31.8,49.43 30.28,47.9 12.8,47.9 11.07,46.18 11.07,40.54 10.11,39.57 9.64,39.57 SC1.S2_3
SERVO3
  Top 0.305: BOARD1.D13 29.21,49.43 29.26,49.38 28.35,48.46 12.45,48.46 10.41,46.43 10.41,43.12 SC1.S3_3
TEMP_1WIRE  (via drill 0.36)
  Top 0.305: TS1.2 v38.66,19.25
  Bottom 0.305: v38.66,19.25 43.08,19.25 47.35,14.99 56.39,14.99 57.81,13.56 57.81,4.27 57.86,4.27 57.86,2.54 BOARD1.A3
VCC
  Top 0.406: U$2.P$2 90.93,44.7 93.22,46.99 94.74,46.99 95.25,47.5 | 95.25,47.5 95.25,50.8 J2.1 J2.36 | 95.25,47.5 95.25,42.67 94.49,41.91 91.44,41.91 IRLED2.A 91.47,37.31 91.47,15.16 89.26,12.95 IRLED1.A

### Text on the board
tPlace: [ | NSL | ] | ADK DEMO SHIELD+ | v1.0 | SERVOS | 3 | R21 | IR SENSOR | 2 | 1 | RELAY 1 | NO | COM | ( )( ) | NC | Light | NO | COM | Temp | www.nullspacelabs.com | NC | RELAY 2 | NOTE: EACH RELAY | RESET | 24VDC 1A MAX | based on work | shared by Google
tDocu: J6 | J5 | J4 | J3 | J1 | J2